# EAGLE design bristol_longshot (EAGLE 6.5.0)
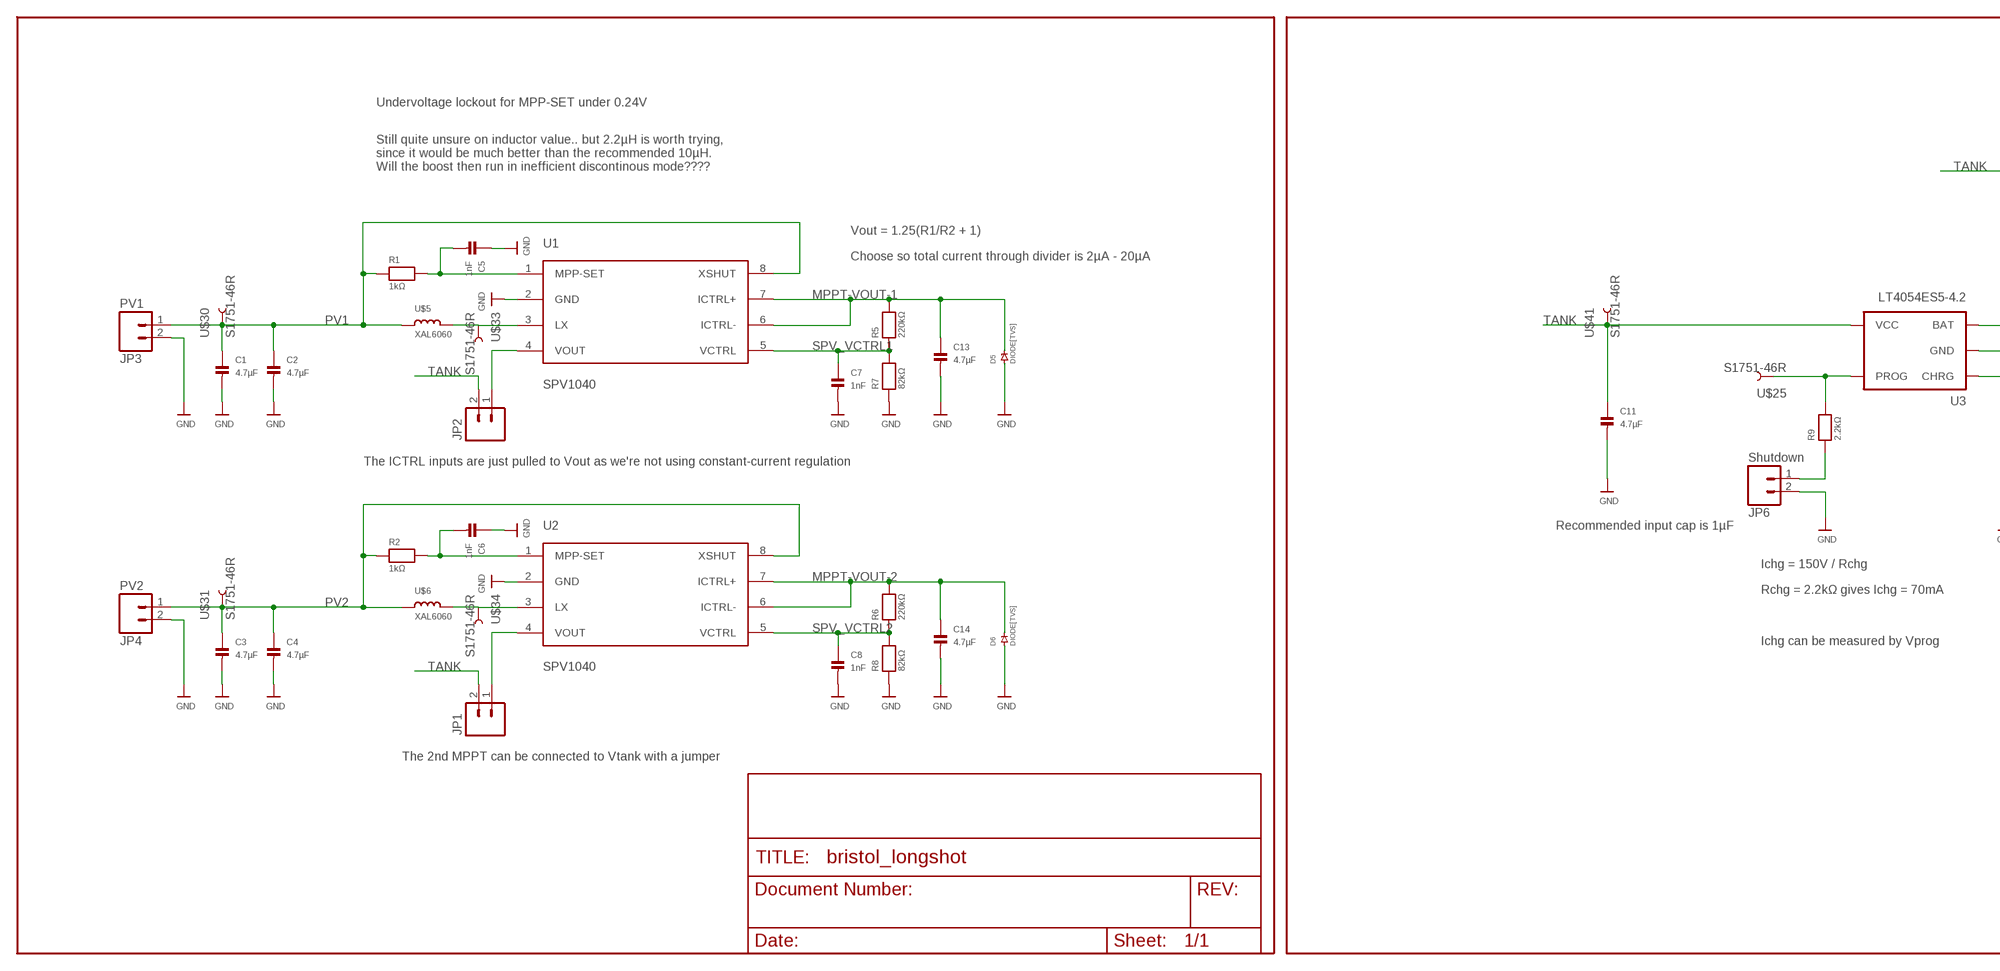
[diagram p0: schematic, sheet 1, part 1 of 2]
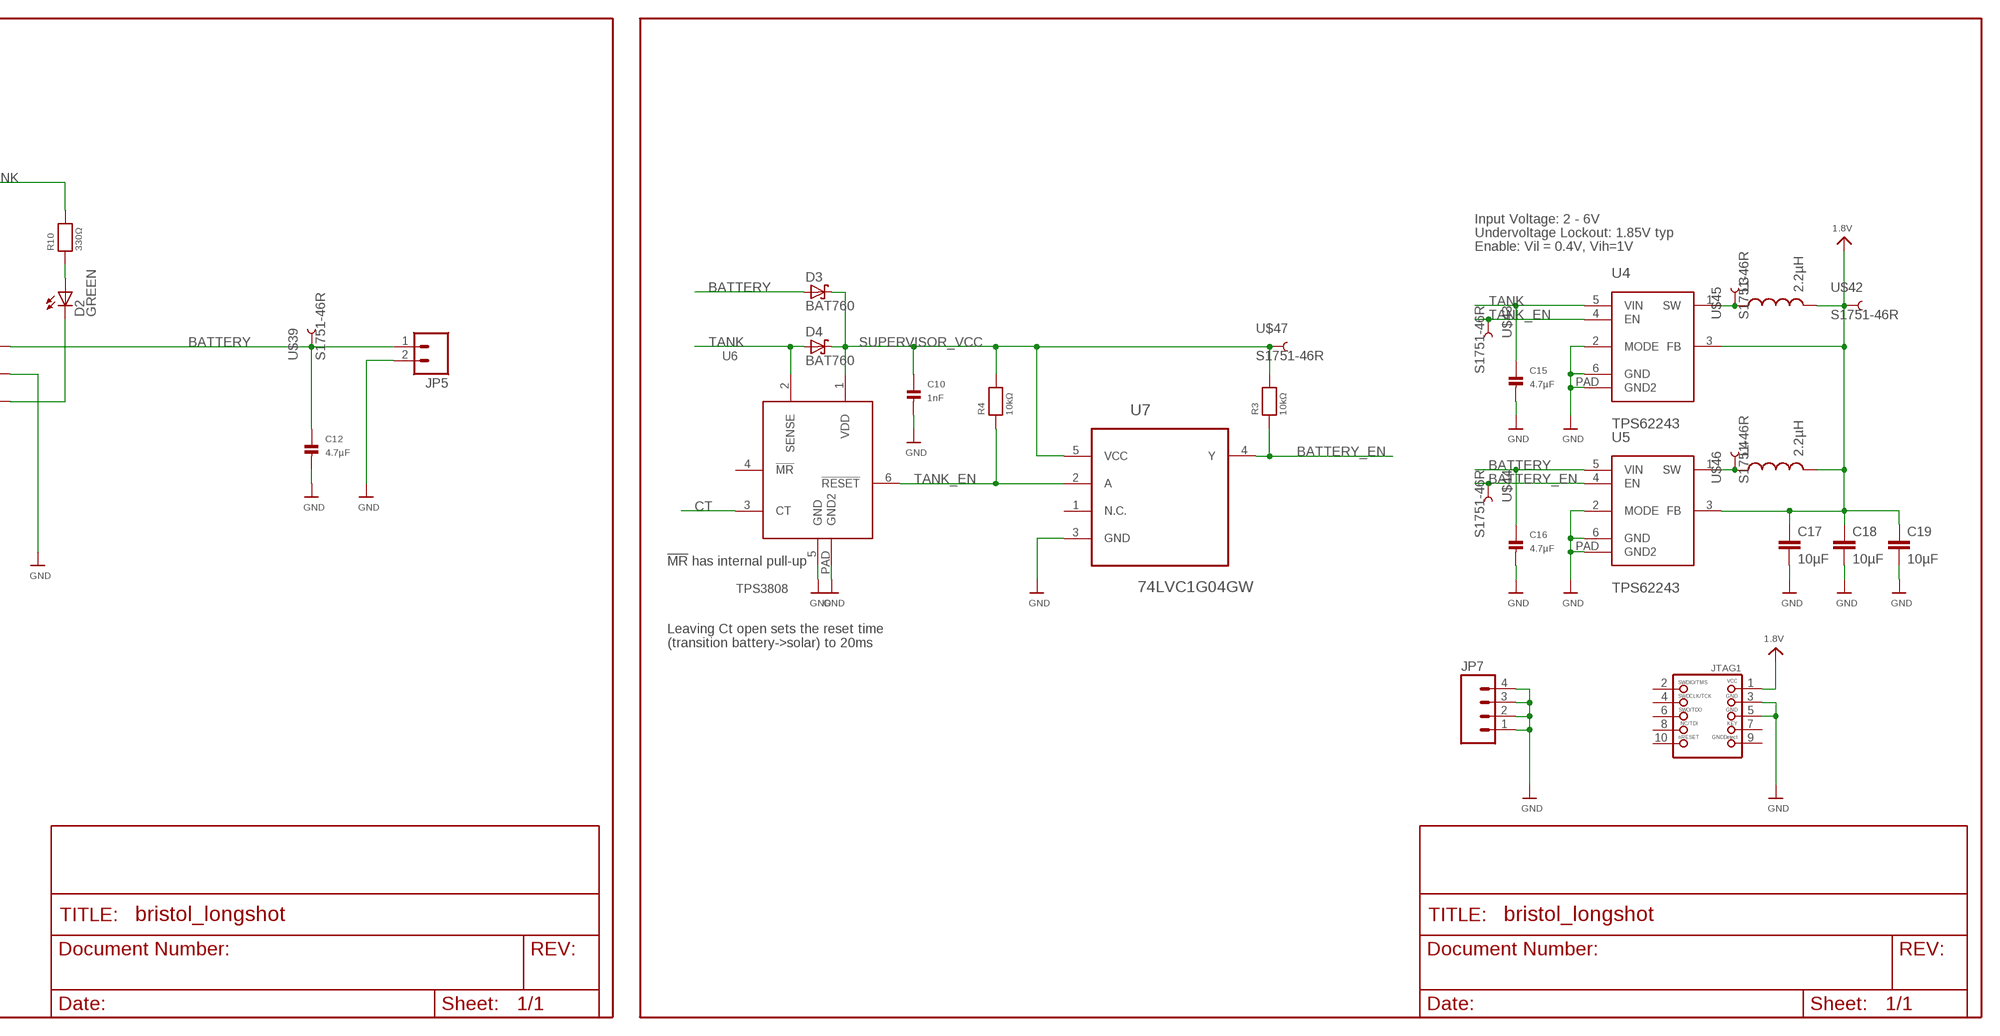
[diagram p1: schematic, sheet 1, part 2 of 2]

## Parts
C1  4.7µF  CAP_CERAMIC_0402  [_0402]
C2  4.7µF  CAP_CERAMIC_0402  [_0402]
C3  4.7µF  CAP_CERAMIC_0402  [_0402]
C4  4.7µF  CAP_CERAMIC_0402  [_0402]
C5  1nF  CAP_CERAMIC_0402  [_0402]
C6  1nF  CAP_CERAMIC_0402  [_0402]
C7  1nF  CAP_CERAMIC_0402  [_0402]
C8  1nF  CAP_CERAMIC_0402  [_0402]
C10  1nF  CAP_CERAMIC_0402  [_0402]
C11  4.7µF  CAP_CERAMIC_0402  [_0402]
C12  4.7µF  CAP_CERAMIC_0402  [_0402]
C13  4.7µF  CAP_CERAMIC_0402  [_0402]
C14  4.7µF  CAP_CERAMIC_0402  [_0402]
C15  4.7µF  CAP_CERAMIC_0402  [_0402]
C16  4.7µF  CAP_CERAMIC_0402  [_0402]
C17  10µF  C-EUC0603K  [C0603K]
C18  10µF  C-EUC0603K  [C0603K]
C19  10µF  C-EUC0603K  [C0603K]
D2  GREEN  LEDCHIPLED_0603  [CHIPLED_0603]
D3  BAT760  [SOD323]
D4  BAT760  [SOD323]
D5  DIODE[TVS]  [SOD123W]
D6  DIODE[TVS]  [SOD123W]
JP1  M02LOCK  [1X02_LOCK]
JP2  M02LOCK  [1X02_LOCK]
JP3  PV1  M023.5MM_LOCK  [SCREWTERMINAL-3.5MM-2_LOCK]
JP4  PV2  M023.5MM_LOCK  [SCREWTERMINAL-3.5MM-2_LOCK]
JP5  M023.5MM_LOCK  [SCREWTERMINAL-3.5MM-2_LOCK]
JP6  Shutdown  M02LOCK  [1X02_LOCK]
JP7  M04LOCK  [1X04_LOCK]
JTAG1  JTAG-CORTEXM3SMT  [2X05_1.27MM_SMT]
L3  2.2µH  INDUCTOR1007  [1007]
L4  2.2µH  INDUCTOR1007  [1007]
R1  1kΩ  RESISTOR_0402  [_0402]
R2  1kΩ  RESISTOR_0402  [_0402]
R3  10kΩ  RESISTOR_0402  [_0402]
R4  10kΩ  RESISTOR_0402  [_0402]
R5  220kΩ  RESISTOR_0402  [_0402]
R6  220kΩ  RESISTOR_0402  [_0402]
R7  82kΩ  RESISTOR_0402  [_0402]
R8  82kΩ  RESISTOR_0402  [_0402]
R9  2.2kΩ  RESISTOR_0402  [_0402]
R10  330Ω  RESISTOR_0402  [_0402]
U1  SPV1040  [TSSOP8]
U2  SPV1040  [TSSOP8]
U3  LT4054ES5-4.2  [SOT23-5]
U4  TPS62243  [S-PWSON-N6]
U5  TPS62243  [S-PWSON-N6]
U6  TPS3808  [S-PWSON-N6]
U7  74LVC1G04GW  [SOT65P210X110-5N]
U$5  XAL6060  [XAL60]
U$6  XAL6060  [XAL60]
U$25  S1751-46R  [S1751-46R]
U$30  S1751-46R  [S1751-46R]
U$31  S1751-46R  [S1751-46R]
U$33  S1751-46R  [S1751-46R]
U$34  S1751-46R  [S1751-46R]
U$39  S1751-46R  [S1751-46R]
U$41  S1751-46R  [S1751-46R]
U$42  S1751-46R  [S1751-46R]
U$43  S1751-46R  [S1751-46R]
U$44  S1751-46R  [S1751-46R]
U$45  S1751-46R  [S1751-46R]
U$46  S1751-46R  [S1751-46R]
U$47  S1751-46R  [S1751-46R]

## Nets
1.8V: C17.1 C18.1 C19.1 JTAG1.1 L3.2 L4.2 U4.3(FB) U5.3(FB) U$42.PAD
BATTERY: C12.1 C16.1 D3.A JP5.1 U3.3(BAT) U5.5(VIN) U$39.PAD
BATTERY_BUCK_SW: L4.1 U5.1(SW) U$46.PAD
BATTERY_EN: R3.1 U5.4(EN) U7.4(Y) U$44.PAD
CHG: D2.C U3.1(CHRG)
CHG_LED: D2.A R10.1
CT: U6.3(CT)
GND: C1.2 C2.2 C3.2 C4.2 C5.1 C6.1 C7.2 C8.2 C10.2 C11.2 C12.2 C13.2 C14.2 C15.2 C16.2 C17.2 C18.2 C19.2 D5.P$1 D6.P$1 JP3.2 JP4.2 JP5.2 JP6.2 JP7.1 JP7.2 JP7.3 JP7.4 JTAG1.3 JTAG1.5 R7.1 R8.1 U1.2(GND) U2.2(GND) U3.2(GND) U4.2(MODE) U4.6(GND) U4.PAD(GND2) U5.2(MODE) U5.6(GND) U5.PAD(GND2) U6.5(GND) U6.PAD(GND2) U7.3(GND)
LX1: U1.3(LX) U$5.P$2 U$33.PAD
LX2: U2.3(LX) U$6.P$2 U$34.PAD
MPP-SET2: C6.2 R2.2 U2.1(MPP-SET)
MPPT-VOUT-1: C13.1 D5.P$2 JP2.1 R5.2 U1.4(VOUT) U1.6(ICTRL-) U1.7(ICTRL+)
MPPT-VOUT-2: C14.1 D6.P$2 JP1.1 R6.2 U2.4(VOUT) U2.6(ICTRL-) U2.7(ICTRL+)
N$1: C5.2 R1.2 U1.1(MPP-SET)
N$5: JP6.1 R9.1
PROG: R9.2 U3.5(PROG) U$25.PAD
PV1: C1.1 C2.1 JP3.1 R1.1 U1.8(XSHUT) U$5.P$1 U$30.PAD
PV2: C3.1 C4.1 JP4.1 R2.1 U2.8(XSHUT) U$6.P$1 U$31.PAD
SPV_VCTRL1: C7.1 R5.1 R7.2 U1.5(VCTRL)
SPV_VCTRL2: C8.1 R6.1 R8.2 U2.5(VCTRL)
SUPERVISOR_VCC: C10.1 D3.C D4.C R3.2 R4.2 U6.1(VDD) U7.5(VCC) U$47.PAD
TANK: C11.1 C15.1 D4.A JP1.2 JP2.2 R10.2 U3.4(VCC) U4.5(VIN) U6.2(SENSE) U$41.PAD
TANK_BUCK_SW: L3.1 U4.1(SW) U$45.PAD
TANK_EN: R4.1 U4.4(EN) U6.6(!RESET) U7.2(A) U$43.PAD
Unconnected: JTAG1.2 JTAG1.4 JTAG1.6 JTAG1.7 JTAG1.8 JTAG1.9 JTAG1.10 U6.4(!MR) U7.1(N.C.)

## Notes on the sheet
- Undervoltage lockout for MPP-SET under 0.24V
- Still quite unsure on inductor value.. but 2.2µH is worth trying,
  since it would be much better than the recommended 10µH.
  Will the boost then run in inefficient discontinous mode????
- Input Voltage: 2 - 6V
- Undervoltage Lockout: 1.85V typ
- Vout = 1.25(R1/R2 + 1) | Enable: Vil = 0.4V, Vih=1V
- Choose so total current through divider is 2µA - 20µA
- The ICTRL inputs are just pulled to Vout as we're not using constant-current regulation
- Recommended input cap is 1µF | !MR! has internal pull-up
- Ichg = 150V / Rchg
- Rchg = 2.2kΩ gives Ichg = 70mA
- Leaving Ct open sets the reset time
  (transition battery->solar) to 20ms
- Ichg can be measured by Vprog
- The 2nd MPPT can be connected to Vtank with a jumper

## Library data of the parts
C1-C8 C10-C16 = microbuilder_v3:CAP_CERAMIC: Ceramic Capacitors 0402 - 0402 Surface Mount Capacitors 16pF 50V 5% [Digikey: 445-4899-2-ND] 18pF 50V 5% [Digikey: 490-1281-2-ND] 22pF 50V 5% [Digikey: 490-1283-2-ND] 68pF 50V 5% [Digikey: 490-1289-2-ND] 0.1uF 10V 10% [Digikey: 490-1318-2-ND] 1.0uF 6.3V 10% [Digikey: 490-1320-2-ND] 0603 - 0603 Surface Mount Capacitors 16 pF 50V 5% [Digikey: 445-5051-2-ND] 22 pF 50V [Digikey: PCC220ACVTR-ND] 33 pF 50V 5% [Digikey: 490-1415-1-ND] 56pF 50V 5% [Digikey: 490-1421-1-ND] 220pF 50V 5% [Digikey: 445-1285-1-ND] 680 pF 50V 2200 pF 50V 5% C0G [Digikey: 445-1297-1-ND] 5600 pF 100V 5% X7R [Digikey: 478-3711-1-ND] 0.1 µF 25V 10% [Digikey: PCC2277TR-ND] 0.22 µF 16V 10% X7R [Digikey: 445-1318-1-ND] 1.0 µF 25V 10% [Digikey: 445-5146-2-ND] 0603 - RF Specific 3pF 250V +/-0.1pF RF [Digikey: 712-1347-1-ND] 18 pF 250V 5% [Digikey: 478-3505-1-ND or 712-1322-1-ND] 56 pF 250V 5% C0G RF [Digikey: 490-4867-1-ND] 68 pF 250V RF [Digikey: 490-4868-1-ND] 0805 - 0805 Surface Mount Capacitors 220 pF 250V 2% RF Ceramic Capacitor [Digikey: 712-1398-1-ND] 1000 pF 50V 2% NP0 Ceramic Capacitor [Digikey: 478-3760-1-ND] 0.1 µF 25V 10% Ceramic Capacitor [Digikey: PCC1828TR-ND] 1.0 µF 16V 10% Ceramic Capacitor[Digikey: 490-1691-2-ND] 10.0 µF 10V 10% Ceramic Capacitor[Digikey: 709-1228-1-ND] 10.0 uF 16V 10% Ceramic Capacitor [Digikey: 478-5165-2-ND] 47 uF 6.3V 20% Ceramic Capacitor [Digikey: 587-1779-1-ND or 399-5506-1-ND] 1206 - 1206 Surface Mount Capacitors 47uF 10V 20% Ceramic Capacitor [Digikey: 490-5528-1-ND or 399-5508-1-ND or 445-6010-1-ND] 100uF 6.3V -20%, +80% Y5V Ceramic Capacitor (Digikey: 490-4512-1-ND, Mouser: 81-GRM31CF50J107ZE1L)
C17-C19 = resistor:C-EU: CAPACITOR, European symbol
D2 = led:LED: LED OSRAM: - CHIPLED LG R971, LG N971, LY N971, LG Q971, LY Q971, LO R971, LY R971 LH N974, LH R974 LS Q976, LO Q976, LY Q976 LO Q996 - Hyper CHIPLED LW Q18S LB Q993, LB Q99A, LB R99A - SideLED LS A670, LO A670, LY A670, LG A670, LP A670 LB A673, LV A673, LT A673, LW A673 LH A674 LY A675 LS A676, LA A676, LO A676, LY A676, LW A676 LS A679, LY A679, LG A679 - Hyper Micro SIDELED® LS Y876, LA Y876, LO Y876, LY Y876 LT Y87S - SmartLED LW L88C, LW L88S LB L89C, LB L89S, LG L890 LS L89K, LO L89K, LY L89K LS L896, LA L896, LO L896, LY L896 - TOPLED LS T670, LO T670, LY T670, LG T670, LP T670 LSG T670, LSP T670, LSY T670, LOP T670, LYG T670 LG T671, LOG T671, LSG T671 LB T673, LV T673, LT T673, LW T673 LH T674 LS T676, LA T676, LO T676, LY T676, LB T676, LH T676, LSB T676, LW T676 LB T67C, LV T67C, LT T67C, LS T67K, LO T67K, LY T67K, LW E67C LS E67B, LA E67B, LO E67B, LY E67B, LB E67C, LV E67C, LT E67C LW T67C LS T679, LY T679, LG T679 LS T770, LO T770, LY T770, LG T770, LP T770 LB T773, LV T773, LT T773, LW T773 LH T774 LS E675, LA E675, LY E675, LS T675 LS T776, LA T776, LO T776, LY T776, LB T776 LHGB T686 LT T68C, LB T68C - Hyper Mini TOPLED® LB M676 - Mini TOPLED Santana® LG M470 LS M47K, LO M47K, LY M47K Source: http://www.osram.convergy.de LUXEON: - LUMILED® LXK2-PW12-R00, LXK2-PW12-S00, LXK2-PW14-U00, LXK2-PW14-V00 LXK2-PM12-R00, LXK2-PM12-S00, LXK2-PM14-U00 LXK2-PE12-Q00, LXK2-PE12-R00, LXK2-PE12-S00, LXK2-PE14-T00, LXK2-PE14-U00 LXK2-PB12-K00, LXK2-PB12-L00, LXK2-PB12-M00, LXK2-PB14-N00, LXK2-PB14-P00, LXK2-PB14-Q00 LXK2-PR12-L00, LXK2-PR12-M00, LXK2-PR14-Q00, LXK2-PR14-R00 LXK2-PD12-Q00, LXK2-PD12-R00, LXK2-PD12-S00 LXK2-PH12-R00, LXK2-PH12-S00 LXK2-PL12-P00, LXK2-PL12-Q00, LXK2-PL12-R00 Source: www.luxeon.com KINGBRIGHT: KA-3528ASYC Source: www.kingbright.com
D3 D4 = BAT760:BAT760
D5 D6 = nxp:DIODE[TVS]
JP1-JP6 = SparkFun:M02: Header 2 Standard 2-pin 0.1" header. Use with straight break away headers (SKU : PRT-00116), right angle break away headers (PRT-00553), swiss pins (PRT-00743), machine pins (PRT-00117), and female headers (PRT-00115). Molex polarized connector foot print use with SKU : PRT-08233 with associated crimp pins and housings.
JP7 = SparkFun:M04: Header 4 Standard 4-pin 0.1" header. Use with straight break away headers (SKU : PRT-00116), right angle break away headers (PRT-00553), swiss pins (PRT-00743), machine pins (PRT-00117), and female headers (PRT-00115). Molex polarized connector foot print use with SKU : PRT-08231 with associated crimp pins and housings. 1MM SMD Version SKU: PRT-10208
JTAG1 = microbuilder_v3:JTAG-CORTEXM3: Serial Wire (SW-DP) Connector This standard 0.05" 10-pin connector is for use with the Cortex M0/M3's native SWD (serial wire debugger) interface (SW-DP). Some boards support a 20-pin combined JTAG+SWD connector (SWJ-DP), such as the LPC1700 family, but many smaller devices only work with SWD which typically use the smaller 10-pin SW-DP connecter (the LPC1300 family, for example, only supports SWD). 2x05 1.27mm/0.05" Connector: This is the standard SMT connector defined by ARM for all Cortex devices, and should be used in most situations and for forward-compatibility since any new devices coming to market will likely use this connector. MOLEX 10 Pin 0.1" Connector: This 0.1" 10 pin connector has the same pin layout as the standard 0.05" connector, but is easier to work with if you are using standard jumper wires or custom cables to connect your SWD hardware. MOLEX 20 Pin 0.1" Connector: This 0.1" 20 pin connector is the same model used for ARM7/ARM9 JTAG debuggers, but is connected to match the pins on the Segger J-Link for ARM (which supports both JTAG and SWD debugging). See the following document from ARM for more information on Cortex M3 Debug Connectors: http://infocenter.arm.com/help/topic/com.arm.doc.faqs/attached/13634/cortex_debug_connectors.pdf And the following page for an overview with images of the different connector types: http://www.keil.com/peripherals/coresight/connectors.asp
L3 L4 = SparkFun:INDUCTOR: Inductors Basic Inductor/Choke - 0603 and 1206. Footprints are not proven and vary greatly between part numbers.
R1-R10 = microbuilder_v3:RESISTOR: Resistors 0402 - 0402 Surface Mount Package 22 Ohm 1% 1/16W [Digikey: 311-22.0LRTR-ND] 33 Ohm 5% 1/16W 1.0K 5% 1/16W 1.5K 5% 1/16W 2.0K 1% 1/16W 10.0K 1% 1/16W [Digikey: 311-10.0KLRTR-ND] 10.0K 5% 1/16W [Digikey: RMCF0402JT10K0TR-ND] 12.1K 1% 1/16W [Digikey: 311-22.0LRTR-ND] 100.0K 5% 1/16W 0603 - 0603 Surface Mount Package 0 Ohm 1/10 Watt 1% Resistor 15 Ohm 1/10 Watt 1% Resistor 33 Ohm 1/10 Watt 1% Resistor 49.9 Ohm 1/10 Watt 1% Resistor 100 Ohm 1/10 Watt 1% Resistor 150 Ohm 1/10 Watt 1% Resistor 240 Ohm 1/10 Watt 1% Resistor 390 Ohm 1/10 Watt 1% Resistor 560 Ohm 1/10 Watt 1% Resistor 680 Ohm 1/10 Watt 1% Resistor 750 Ohm 1/10 Watt 1% Resistor 1.0K Ohm 1/10 Watt 1% Resistor 1.5K Ohm 1/10 Watt 1% Resistor 2.0K Ohm 1/10 Watt 1% Resistor 2.2K Ohm 1/10 Watt 1% Resistor 3.3K Ohm 1/10 Watt 1% Resistor 4.7K Ohm 1/10 Watt 1% Resistor 10.0K Ohm 1/10 Watt 1% Resistor 12.0K Ohm 1/10 Watt 1% Resistor 12.1K Ohm 1/10 Watt 1% Resistor 20.0K Ohm 1/10 Watt 1% Resistor 33.0K Ohm 1/10 Watt 1% Resistor 100.0K Ohm 1/10 Watt 1% Resistor 0805 - 0805 Surface Mount Package 0 Ohm 1/8 Watt 1% Resistor 33 Ohm 1/8 Watt 1% Resistor 100 Ohm 1/8 Watt 1% Resistor 150 Ohm 1/8 Watt 1% Resistor 200 Ohm 1/8 Watt 1% Resistor 240 Ohm 1/8 Watt 1% Resistor 330 Ohm 1/8 Watt 1% Resistor 390 Ohm 1/8 Watt 1% Resistor 470 Ohm 1/8 Watt 1% Resistor 1.0K Ohm 1/8 Watt 1% Resistor 1.5K Ohm 1/8 Watt 1% Resistor 2.0K Ohm 1/8 Watt 1% Resistor 4.7K Ohm 1/8 Watt 1% Resistor 5.1K Ohm 1/8 Watt 1% Resistor 5.6K Ohm 1/8 Watt 1% Resistor 10.0K Ohm 1/8 Watt 1% Resistor 22.0K Ohm 1/8 Watt 1% Resistor 33.0K Ohm 1/8 Watt 1% Resistor 100K Ohm 1/8 Watt 1% Resistor 1206 - 1206 Surface Mount Package 2012 - 2010 Surface Mount Package 0.11 Ohm 1/2 Watt 1% Resistor - Digikey: RHM.11UCT-ND
U1 U2 = spv1040:SPV1040
U3 = XYKlib:LT4054: Standalone Linear Li-Ion Battery Charger A complete constant-current/constant voltage linear charger for single cell lithium-ion batteries.in SOT-23-5 package.
U4 U5 = TPS62243:TPS62243
U6 = TPS3808:TPS3808
U7 = 74LVC1G04GW_inverter:74LVC1G04GW: Single inverter; MPN: 74LVC1G04GW; OC_FARNELL: 1631683; OC_NEWARK: 03P2774; PACKAGE: SOT-5; SUPPLIER: NXP
U$5 U$6 = XAL6060:XAL6060
U$25 U$30 U$31 U$33 U$34 U$39 U$41-U$47 = Harwin-Test-Point:S1751-46R

## Board
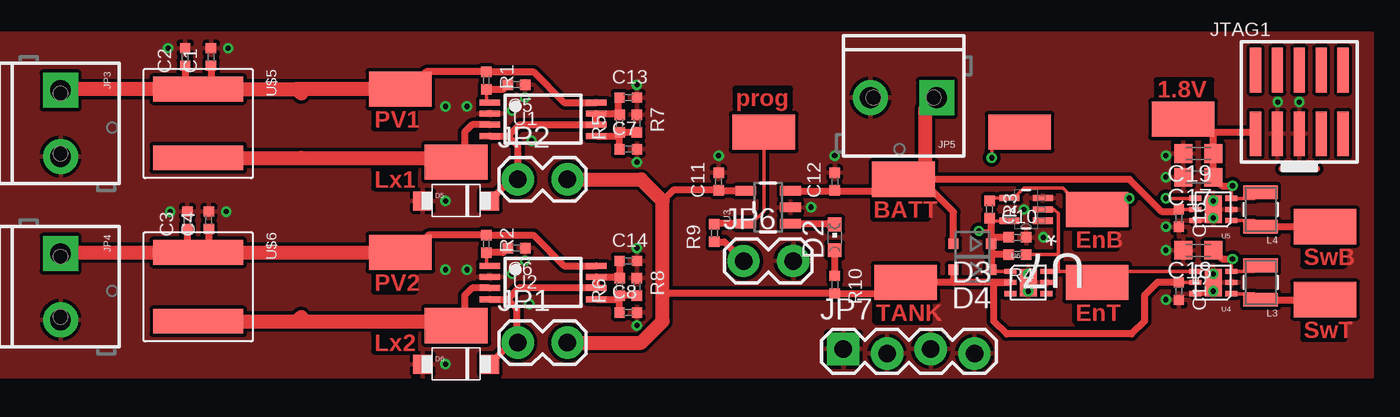
[diagram p2: board, top side]
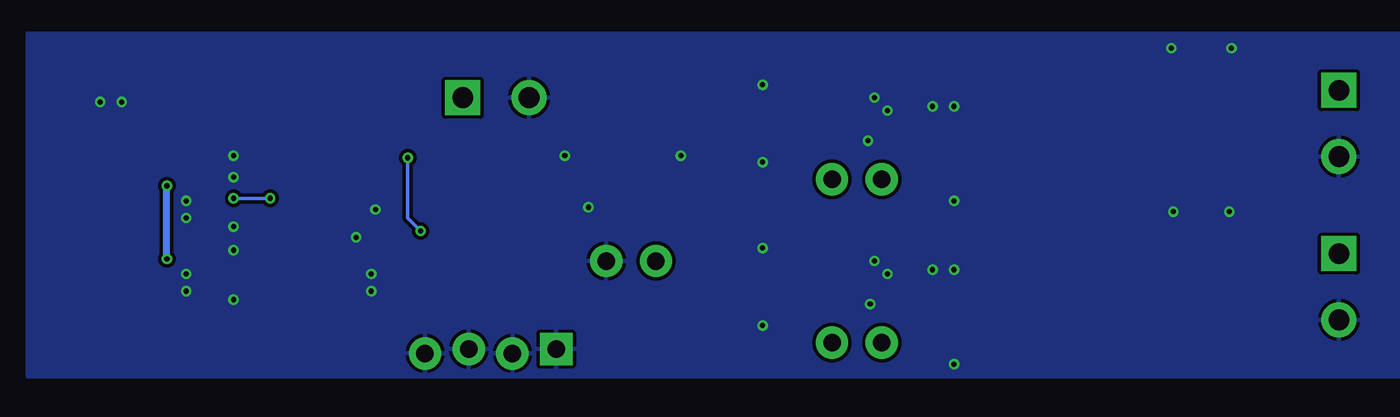
[diagram p3: board, bottom side, seen from below]

No outline drawn. Coordinates in mm, seen from the top.
Copper layers (1*16): Top 0.035mm / dielectric 1.5mm / Bottom 0.035mm
Design rules "PCB-POOL Standard *": minimum track width 0.15mm, minimum drill 0.3mm, track to track 0.15mm, track to pad 0.15mm, pad to pad 0.15mm, via to via 0.15mm, smd to smd 0.15mm, copper to edge 0.3mm, drill to drill 0.2mm, minimum pad ring 0.2mm, minimum via ring 0.15mm, stop-mask expansion 0.075mm, vias tented up to drill 0.3mm, thermal gap 0.2mm

### Footprints (pad centres in the part's own frame; a part is rotated, then mirrored left to right if it is on the bottom)
_0402 = smd 0.6 x 0.6: 1 -0.508,0; 2 0.508,0
C0603K = smd 1.05 x 1.08: 1 -0.875,0; 2 0.875,0
CHIPLED_0603 = smd 0.8 x 0.8: A 0,-0.75; C 0,0.75
SOD323 = smd 0.6 x 0.6: A 1.1,0; C -1.1,0
SOD123W = smd 1.1 x 1.1: P$1 -1.95,0; P$2 1.95,0
1X02_LOCK = drill 1.016 pad 1.88: 1 -0.178,0; 2 2.718,0
SCREWTERMINAL-3.5MM-2_LOCK = drill 1.2 pad 2.032 square: 1 -0.178,0 | drill 1.2 pad 2.032: 2 3.678,0
1X04_LOCK = drill 1.016 pad 1.88 square: 1 0,0.127 | drill 1.016 pad 1.88: 2 2.54,-0.127; 3 5.08,0.127; 4 7.62,-0.127
2X05_1.27MM_SMT = smd 0.65 x 2.6: 1 -2.54,-1.85; 2 -2.54,1.85; 3 -1.27,-1.85; 4 -1.27,1.85; 5 0,-1.85; 6 0,1.85; 7 1.27,-1.85; 8 1.27,1.85; 9 2.54,-1.85; 10 2.54,1.85
1007 = smd 2 x 0.8: 1 0,1; 2 0,-1
TSSOP8 = smd 1.2 x 0.35: 1 -0.8,0.475; 2 -0.8,-0.175; 3 -0.8,-0.825; 4 -0.8,-1.475; 5 5.4,-1.475; 6 5.4,-0.825; 7 5.4,-0.175; 8 5.4,0.475
SOT23-5 = smd 0.55 x 1.2: 1 -0.95,-1.3; 2 0,-1.3; 3 0.95,-1.3; 4 0.95,1.3; 5 -0.95,1.3
S-PWSON-N6 = smd 0.3 x 0.7: 1 -0.65,-1.05; 2 0,-1.05; 3 0.65,-1.05; 4 0.65,1.05; 5 0,1.05; 6 -0.65,1.05 | smd 1.6 x 1: PAD 0,0
SOT65P210X110-5N = smd 1.168 x 0.356: 1 -0.965,0.66; 2 -0.965,0; 3 -0.965,-0.66; 4 0.965,-0.66; 5 0.965,0.66
XAL60 = smd 1.43 x 5.24: P$1 -2,0; P$2 2,0
S1751-46R = smd 3.65 x 2.05: PAD 0,0

### Placement (x,y rotation side)
C1  12.5,18.62 90 top
C2  11,18.62 90 top
C3  11.12,9.12 90 top
C4  12.38,9.12 90 top
C5  30.25,17 180 top
C6  30.25,7.5 180 top
C7  36.75,13.25 0 top
C8  36.75,3.75 0 top
C10  59.38,8.12 0 top
C11  42,11.38 90 top
C12  48.75,11.38 90 top
C13  36.75,16.25 0 top
C14  36.75,6.75 0 top
C15  68.75,5 270 top
C16  68.75,9.25 270 top
C17  69.88,11.62 180 top
C18  69.88,7.38 180 top
C19  69.88,13 180 top
D2  48.75,8.12 0 top
D3  56.75,7.75 180 top
D4  56.75,6.25 180 top
D5  26.75,10.25 0 top
D6  26.75,0.75 0 top
JP1  30.5,2 0 top
JP2  30.5,11.5 0 top
JP3  3.75,16.5 270 top
JP4  3.75,7 270 top
JP5  54.5,16.25 180 top
JP6  43.62,6.75 0 top
JP7  49.25,1.5 0 top
JTAG1  75.75,16 0 top
L3  73.5,5.5 180 top
L4  73.5,9.75 180 top
R1  28.5,17.25 270 top
R2  28.5,7.75 270 top
R3  57.75,9.75 270 top
R4  59.38,7.12 180 top
R5  36.25,14.75 90 top
R6  36.25,5.25 90 top
R7  37.25,14.75 270 top
R8  37.25,5.25 270 top
R9  41.75,8.38 90 top
R10  48.75,5.38 270 top
U1  29.5,15.5 0 top
U2  29.5,6 0 top
U3  44.88,9.88 90 top
U4  70.75,5.5 90 top
U5  70.75,9.75 90 top
U6  60,5.5 270 top
U7  59.88,9.75 180 top
U$5  11.75,14.75 270 top
U$6  11.75,5.25 270 top
U$25  44.62,14.25 0 top
U$30  23.5,16.75 180 top
U$31  23.5,7.25 180 top
U$33  26.75,12.5 180 top
U$34  26.75,3 180 top
U$39  52.75,11.5 180 top
U$41  52.88,5.5 0 top
U$42  69,15 0 top
U$43  64,5.5 180 top
U$44  64,9.75 180 top
U$45  77.25,4.5 0 top
U$46  77.25,8.75 0 top
U$47  59.5,14.25 180 top

### Tracks (layer width: path | path; a pad name or v marks a point on that pad's centre or on a via)
1.8V  (via drill 0.3)
  Top 0.2: L3.2 73.15,6.15 U4.3 71.8,6.8 v71.88,6.88 | L4.2 73.15,10.4 U5.3 71.8,11.05 v71.88,11.12
  Top 0.4: 73.21,10.75 L4.2 | U$42.PAD 70.66,14.29 | 70.66,14.29 70.75,14.25 | 70.75,14.25 73.21,14.25 JTAG1.1 | C18.1 71.25,6.88 v71.88,6.88 | v71.88,11.12 71.25,11.12 C17.1 C19.1 | C19.1 70.75,14.25 | C19.1 70.75,14.2 70.66,14.29
  Bottom 0.4: v71.88,6.88 v71.88,11.12
BATTERY
  Top 0.2: U5.5 C16.1
  Top 0.4: D3.A 55.65,9.6 53.62,11.62 | C16.1 68.62,9.63 67.74,9.63 65.88,11.5 53.5,11.5 U$39.PAD 52,11.5 51.33,10.82 48.79,10.82 | U3.3 48.79,10.82 | C12.1 48.79,10.82
  Top 0.8: 53.5,11.5 53.62,11.62 54,12 54,15.57 JP5.1
BATTERY_BUCK_SW
  Top 0.2: U5.1 73.15,9.1 L4.1
  Top 0.4: L4.1 U$46.PAD
BATTERY_EN  (via drill 0.3)
  Top 0.2: R3.1 57.9,10.41 U7.4 59.16,10.41 59.75,11 62,11 63,10 63.75,10 U$44.PAD 64.65,10.4 v65.88,10.4 | U5.4 v68,10.4
  Bottom 0.2: v65.88,10.4 v68,10.4
CHG
  Top 0.4: U3.1 48.7,8.93 D2.C
CHG_LED
  Top 0.4: R10.1 D2.A
GND  (via drill 0.3)
  Top 0.2: U5.6 70.75,9.1 v70.75,9.25 | U4.6 70.75,4.85 v70.75,5
  other vias: 70.75,10.25 70.75,6 60,6 60,5 59.75,9.75 30.75,6.75 10.12,9.62 13.38,9.62 30,6 37.25,7.5 37.25,3 30.75,16.25 30,15.5 37.25,12.5 37.25,17 10,19.12 13.5,19.12 42,12.88 48.75,12.88 47.38,9.88 26.12,15.75 27.38,15.75 26.12,6.25 27.38,6.25 68,8.75 68,4.5 68,7.38 68,11.62 31.12,13.75 31,4.25 74.5,16 75.75,16 60.88,8.12 26.12,0.75 26.12,10.25 68,12.88
  pour Top (isolate 0.2): 0,20 80,20 80,0 0,0
  pour Bottom (isolate 0.2): 0,20 80,20 80,0 0,0
LX1
  Top 0.4: U1.3 27.68,14.68 27.25,14.25 27.25,13 U$33.PAD
  Top 0.8: U$5.P$2 17.75,12.75 26.5,12.75 U$33.PAD
LX2
  Top 0.4: U2.3 27.68,5.17 27.25,4.75 27.25,3.5 U$34.PAD
  Top 0.8: U$6.P$2 17.5,3.25 | 17.5,3.25 26.5,3.25 U$34.PAD | 17.75,3.5 17.5,3.25
MPP-SET2
  Top 0.2: R2.2 28.5,6.47 U2.1
  Top 0.4: C6.2 29.48,7.24 R2.2
MPPT-VOUT-1
  Top 0.4: 36.18,15.32 U1.7 U1.6 30.43,14.68 29.77,14.03 | 36.18,15.32 R5.2 | U1.4 29.77,14.03 | 29.77,14.03 30.32,13.48 JP2.1 29.95,11.5 D5.P$2 | 36.18,15.32 36.18,16.19 C13.1
MPPT-VOUT-2
  Top 0.4: U2.4 29.73,4.53 | 29.73,4.53 30.25,4 30.25,2.07 JP1.1 29.95,2 D6.P$2 | 29.73,4.53 30.38,5.17 U2.6 U2.7 36.18,5.83 R6.2 C14.1
N$1
  Top 0.2: R1.2 28.5,15.97 U1.1
  Top 0.4: R1.2 29.48,16.74 C5.2
N$4
  Top 0.4: 74.75,12.12 76.75,12.12
N$5
  Top 0.4: R9.1 42.33,7.87 JP6.1
PROG
  Top 0.2: U3.5 43.92,8.93 44.62,9.62 U$25.PAD
  Top 0.4: U3.5 41.79,8.93 R9.2
PV1
  Top 0.4: U1.8 33.02,15.97 31.24,17.76 R1.1 25.01,17.76 24,16.75 | C2.1 11,17.25 U$5.P$1 12.5,17.25 C1.1
  Top 0.8: 17.5,16.75 U$30.PAD 24,16.75 | JP3.1 3.75,16.75 U$5.P$1 17.5,16.75 | 17.75,16.5 17.5,16.75
PV2
  Top 0.4: U2.8 33.02,6.47 31.24,8.26 R2.1 25.13,8.26 24.12,7.25 U$31.PAD | C3.1 11.12,7.88 U$6.P$1 | C4.1 12.38,7.88 12.25,7.75 12.25,7.25
  Top 0.8: 3.75,7.25 JP4.1 3.82,7.25 U$6.P$1 12.25,7.25 U$31.PAD
SPV_VCTRL1
  Top 0.4: R5.1 R7.2 | C7.1 R5.1 | U1.5 36.03,14.03 R5.1
SPV_VCTRL2
  Top 0.4: U2.5 36.03,4.53 R6.1 | C8.1 R6.1 | R8.2 R6.1
SUPERVISOR_VCC  (via drill 0.3)
  Top 0.2: U7.5 57.9,9.09 57.85,9.14 | U6.1 57.95,6.15 D4.C | 57.88,8.12 57.75,8.12 57.75,8.5 v57.12,8.5 | v57.88,12.75 57.88,14.25 U$47.PAD
  Top 0.4: 57.85,7.12 D3.C 57.85,8.12 | 57.85,7.12 D4.C | 57.85,8.12 57.85,9.14 R3.2 | C10.1 57.88,8.12 57.85,8.12 | R4.2 57.85,7.12
  Bottom 0.2: v57.12,8.5 57.88,9.25 v57.88,12.75
TANK
  Top 0.2: U4.5 C15.1
  Top 0.4: 55.65,5.5 U6.2 58,5.5 58,3.25 58.75,2.5 66,2.5 66.75,3.25 66.75,4.75 67.51,5.51 C15.1 | 55.65,5.5 U$41.PAD 51.43,5.5 51.43,4.95 51.5,4.88 R10.2 38.88,4.88 38.75,4.75 | D4.A 55.65,5.5 | U3.4 42.04,10.82 C11.1 39.37,10.87 38.75,10.25
  Top 0.8: JP1.2 37.5,2 38.75,3.25 38.75,4.75 38.75,10.25 37.5,11.5 JP2.2
TANK_BUCK_SW
  Top 0.2: U4.1 73.15,4.85 L3.1
  Top 0.4: L3.1 U$45.PAD
TANK_EN
  Top 0.2: U4.4 64.65,6.15 U$43.PAD 63.35,6.15 61.75,6.15 | U6.6 61.75,6.15 | U7.2 61.5,9.75 61.75,9.5 61.75,7.12 | 61.75,7.12 61.75,6.15 | R4.1 61.75,7.12

### Text on the board
Top: prog | 1.8V | PV1 | Lx1 | BATT | EnB | SwB | PV2 | TANK | EnT | Lx2 | SwT